# Altium schematic sheet Sch_Power.SchDoc
size A4; ENG_APP_DATE: --/--/--; DSN_APP_DATE: --/--/--; CHK_APP_DATE: --/--/--; CompanyName: Universidade Federal de Santa Maria; Organization: Universidade Federal de Santa Maria; Address1: Av. Roraima 1000; Address2: Camobi; Address3: Santa Maria - RS; Address4: Brasil; SheetNumber: 3; SheetTotal: 6
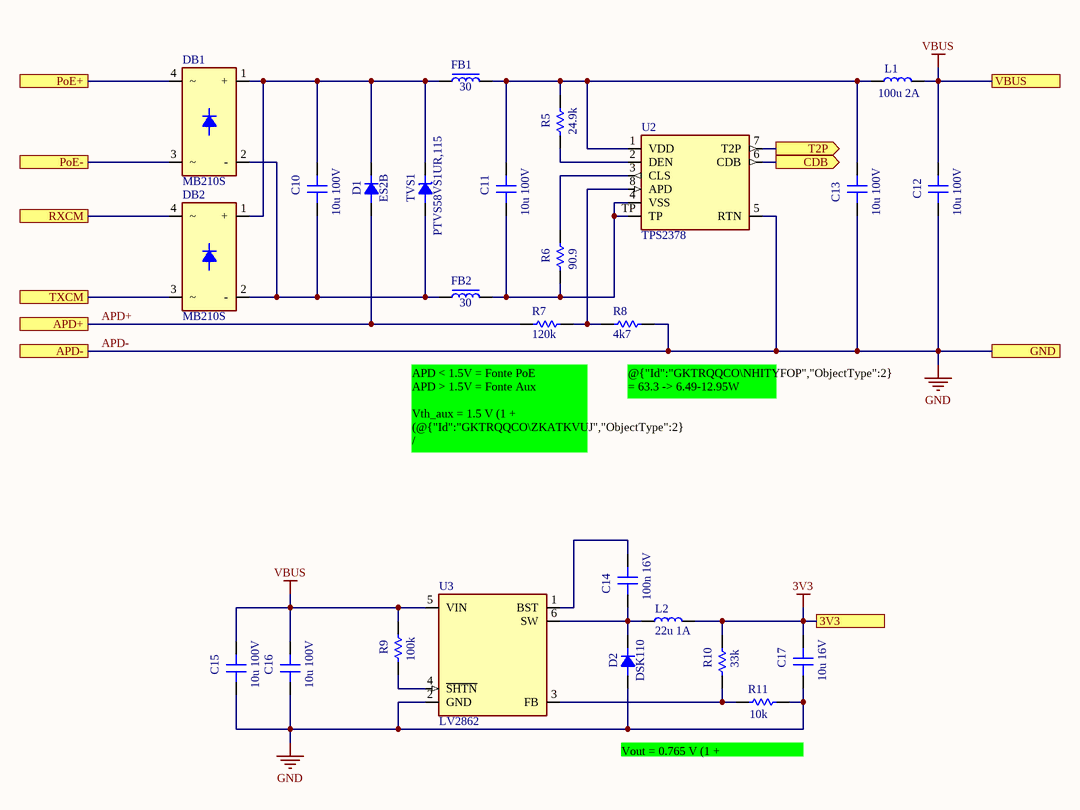
[diagram p0: Sch_Power.SchDoc]

## Parts
C10  10u 100V  [CAP_SMD_1210]
C11  10u 100V  [CAP_SMD_1210]
C12  10u 100V  [CAP_SMD_1210]
C13  10u 100V  [CAP_SMD_1210]
C14  100n 16V  [CAP_SMD_0603]
C15  10u 100V  [CAP_SMD_1210]
C16  10u 100V  [CAP_SMD_1210]
C17  10u 16V  [CAP_SMD_1210]
D1  ES2B  [D_SMA]
D2  DSK110  [D_SMD_SOD123W]
DB1  MB210S  [IC_MBS]
DB2  MB210S  [IC_MBS]
FB1  30  [FB_SMD_0805]
FB2  30  [FB_SMD_0805]
L1  100u 2A  [IND_SMD7.1x6.6x5]
L2  22u 1A  [IND_SMD3x3x1.2mm]
R5  24.9k  [RES_SMD_0603]
R6  90.9  [RES_SMD_0603]
R7  120k  [RES_SMD_0603]
R8  4k7  [RES_SMD_0603]
R9  100k  [RES_SMD_0603]
R10  33k  [RES_SMD_0603]
R11  10k  [RES_SMD_0603]
TVS1  PTVS58VS1UR,115  [D_SOD123W]
U2  TPS2378  [IC_SOIC8_TP]
U3  LV2862  [IC_SOT23_6]

## Ports
3V3, APD+, APD-, CDB (out), GND, PoE+, PoE-, RXCM, T2P (out), TXCM, VBUS

## Nets
3V3: C17.1 L2.2 R10.1 ; port 3V3
APD-: C12.2 C13.2 C15.2 C16.2 C17.2 D2.A R8.2 R11.2 U2.5(RTN) U3.2(GND) ; port APD-, port GND  [also labelled GND]
VBUS: C12.1 C15.1 C16.1 L1.2 R9.1 U3.5(VIN) ; port VBUS
APD+: D1.A R7.1 ; port APD+
CDB: U2.6(CDB) ; port CDB
PoE+: DB1.4 ; port PoE+
PoE-: DB1.3 ; port PoE-
RXCM: DB2.4 ; port RXCM
T2P: U2.7(T2P) ; port T2P
TXCM: DB2.3 ; port TXCM
NetC10_1: C10.1 D1.K DB1.1(+) DB2.1(+) FB1.1 TVS1.K
NetC10_2: C10.2 DB1.2(-) DB2.2(-) FB2.1 TVS1.A
NetC11_1: C11.1 C13.1 FB1.2 L1.1 R5.1 U2.1(VDD)
NetC11_2: C11.2 FB2.2 R6.2 U2.4(VSS) U2.TP
NetC14_1: C14.1 U3.1(BST)
NetC14_2: C14.2 D2.K L2.1 U3.6(SW)
NetR5_2: R5.2 U2.2(DEN)
NetR6_1: R6.1 U2.3(CLS)
NetR7_2: R7.2 R8.1 U2.8(APD)
NetR9_2: R9.2 U3.4(~{SHTN})
NetR10_2: R10.2 R11.1 U3.3(FB)

## Notes on the sheet
- (near R8) @{"Id":"GKTRQQCO\NHITYFOP","ObjectType":2} = 63.3 -> 6.49-12.95W
  @{"Id":"GKTRQQCO\NHITYFOP","ObjectType":2} = 90.9 -> 12.95-25.5W
- APD < 1.5V = Fonte PoE
  APD > 1.5V = Fonte Aux
  Vth_aux = 1.5 V (1 + (@{"Id":"GKTRQQCO\ZKATKVUJ","ObjectType":2} / @{"Id":"GKTRQQCO\COZMLFHK","ObjectType":2}))
  Vth_aux = 39.8V
- (near R11) Vout = 0.765 V (1 + (@{"Id":"GKTRQQCO\DMOJSVDS","ObjectType":2} / @{"Id":"GKTRQQCO\RENRJCZA","ObjectType":2}))
- Engineers
- Title
- Size:
- Date:
- A4
- Number:
- Time:
- Revision:
- Sheet
- of
- File:

## Library data of the parts
C10-C17 = CAP_SMD: Capacitor SMD - Generic
D1 = ES1J: 100V 2A Super Fast Recovery Rectifier; Datasheet: https://www.onsemi.com/download/data-sheet/pdf/es1j-d.pdf
D2 = DIODE_SMD: 100V 1A Schottky Barrier Diode
DB1 DB2 = MB2S: 100 2A diode bridge; MF: Fortune Semiconductor; MP: DW01A; SnapEDA_Link: https://www.snapeda.com/parts/DW01A/Fortune+Semiconductor/view-part/?ref=snap; Package: SOT-23-6 Fortune Semiconductor; Value: *; Check_prices: https://www.snapeda.com/parts/DW01A/Fortune+Semiconductor/view-part/?ref=eda
FB1 FB2 = FB_SMD: Ferrite bead SMD - Generic
L1 L2 = IND_SMD: Inductor SMD - Generic
R5-R11 = RES_SMD: Resistor SMD - Generic
TVS1 = ZENER_SMD: SMD zener diode - Generic
U2 = TPS2378: IEEE 802.3at PoE High-Power PD Interface; MF: Fortune Semiconductor; MP: DW01A; SnapEDA_Link: https://www.snapeda.com/parts/DW01A/Fortune+Semiconductor/view-part/?ref=snap; Package: SOT-23-6 Fortune Semiconductor; Value: *; Check_prices: https://www.snapeda.com/parts/DW01A/Fortune+Semiconductor/view-part/?ref=eda
U3 = LV2862: Buck converter controller; Datasheet: https://www.littelfuse.com/assetdocs/littelfuse-integrated-circuits-mxhv9910-datasheet?assetguid=0135616d-093f-45d8-8766-b0e533f2ef99